# Altium schematic sheet 01_digital_back_end.SchDoc
size A3; SheetNumber: 1; SheetTotal: 2
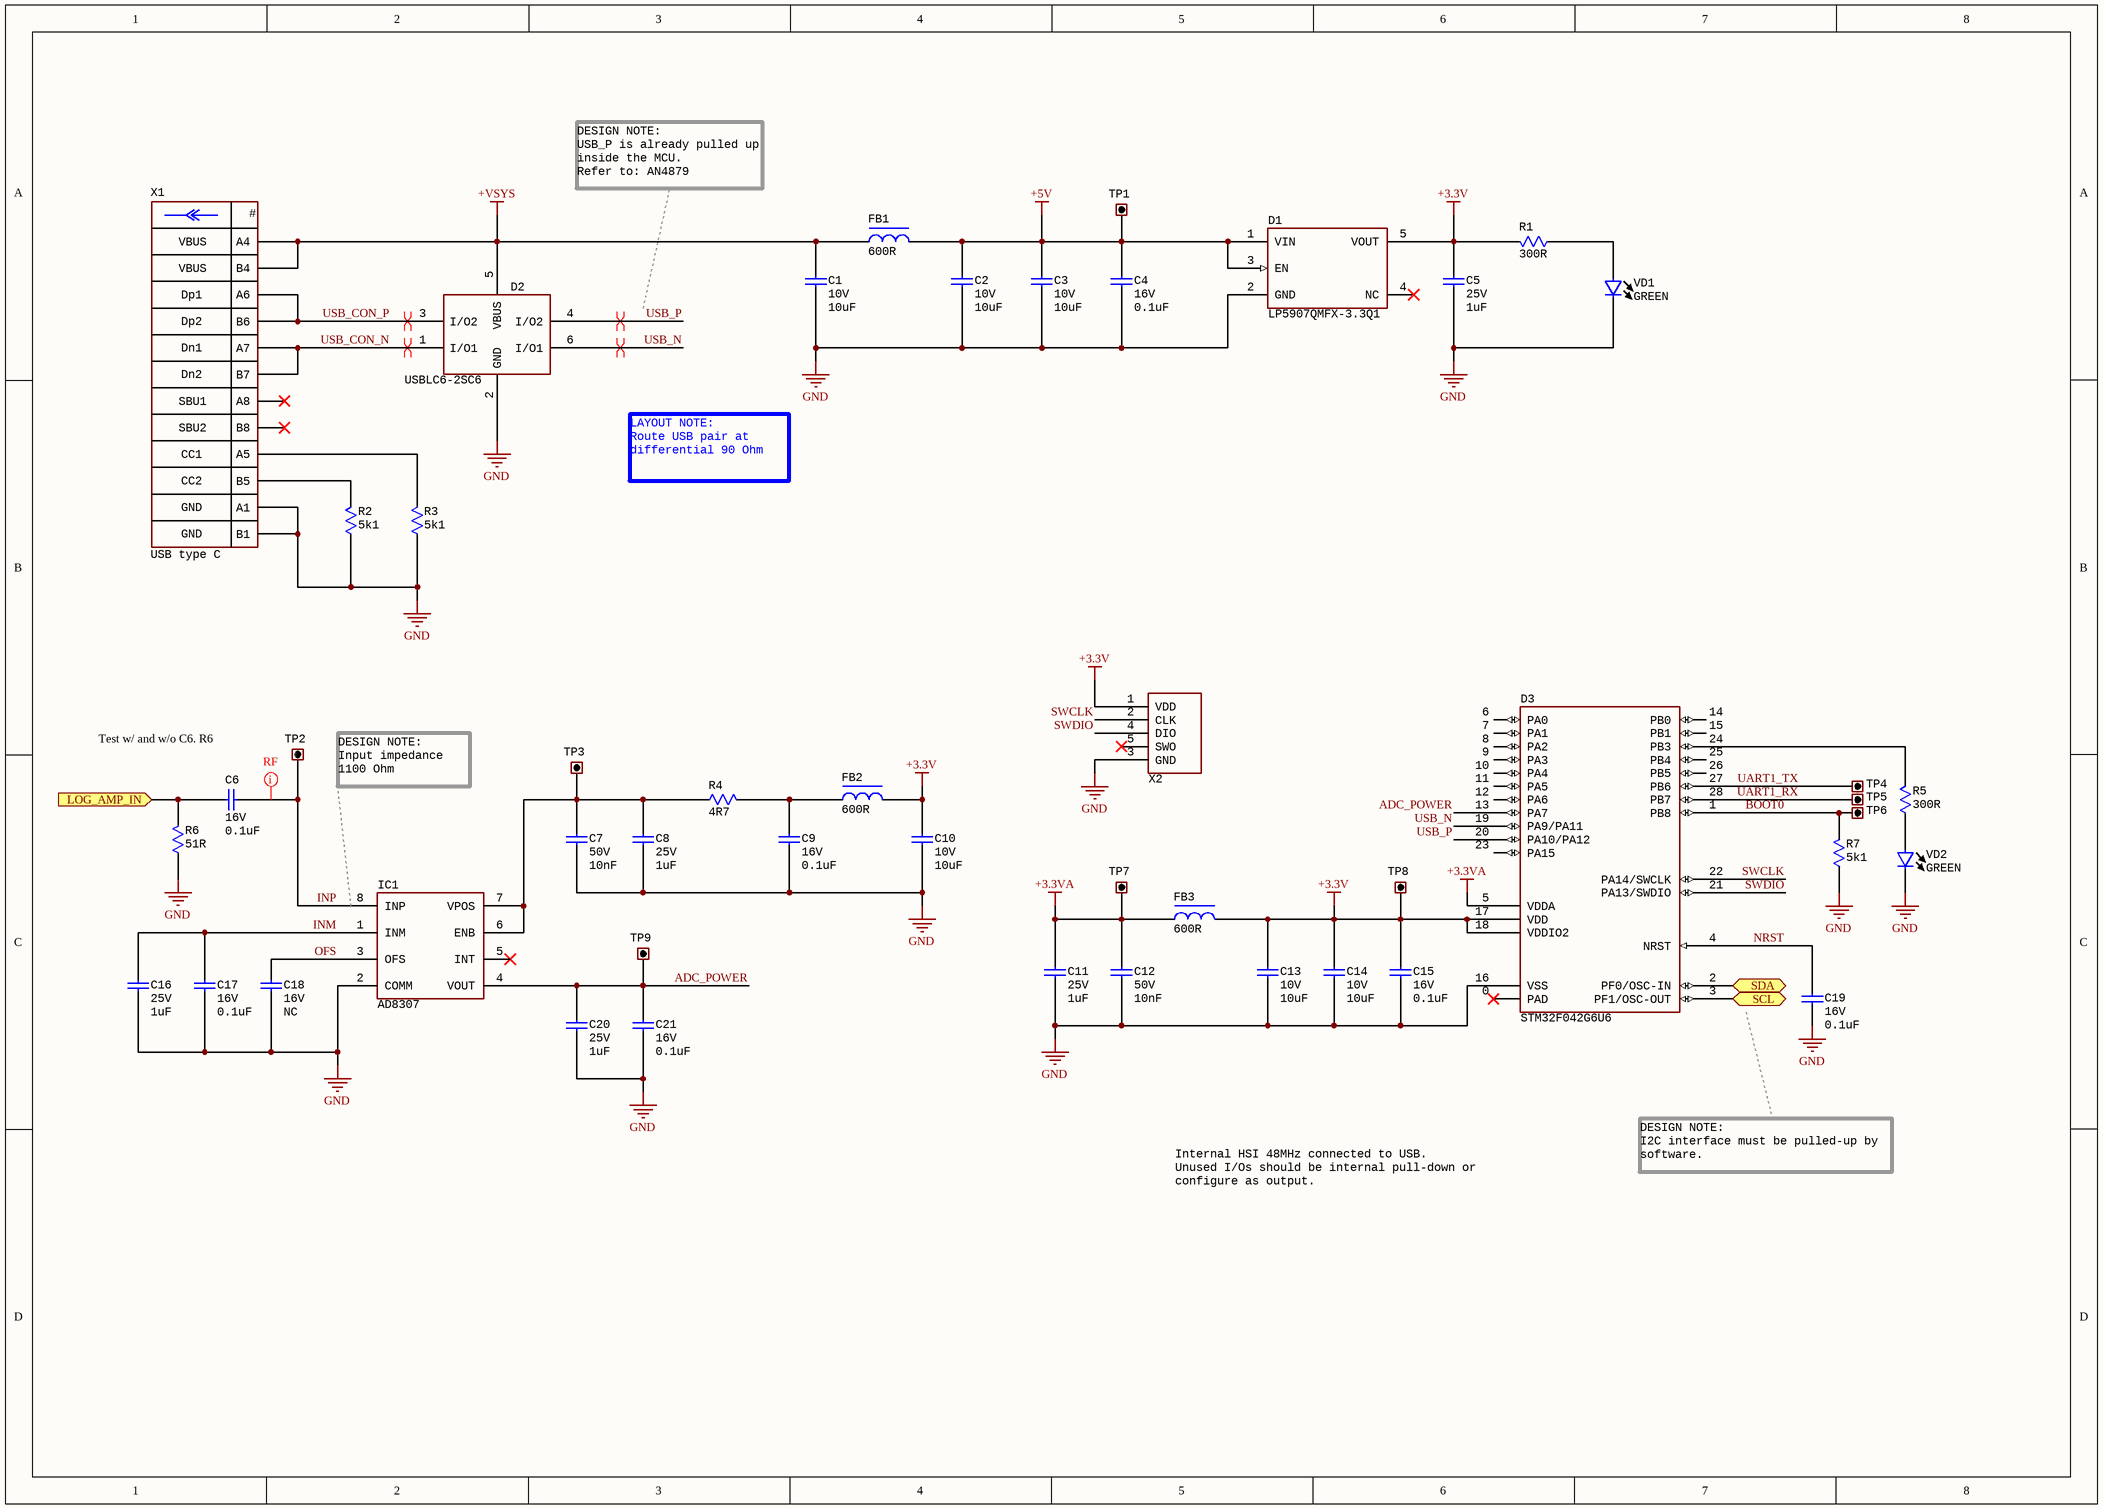
[diagram p0: 01_digital_back_end.SchDoc]

## Parts
C1  value 10uF  Voltage: 10V  [CAP: 0603]
C2  value 10uF  Voltage: 10V  [CAP: 0603]
C3  value 10uF  Voltage: 10V  [CAP: 0603]
C4  value 0.1uF  Voltage: 16V  [CAP: 0402]
C5  value 1uF  Voltage: 25V  [CAP: 0402]
C6  value 0.1uF  Voltage: 16V  [CAP: 0402]
C7  value 10nF  Voltage: 50V  [CAP: 0402]
C8  value 1uF  Voltage: 25V  [CAP: 0402]
C9  value 0.1uF  Voltage: 16V  [CAP: 0402]
C10  value 10uF  Voltage: 10V  [CAP: 0603]
C11  value 1uF  Voltage: 25V  [CAP: 0402]
C12  value 10nF  Voltage: 50V  [CAP: 0402]
C13  value 10uF  Voltage: 10V  [CAP: 0603]
C14  value 10uF  Voltage: 10V  [CAP: 0603]
C15  value 0.1uF  Voltage: 16V  [CAP: 0402]
C16  value 1uF  Voltage: 25V  [CAP: 0402]
C17  value 0.1uF  Voltage: 16V  [CAP: 0402]
C18  value NC  Voltage: 16V  [CAP: 0402]  (no BOM)
C19  value 0.1uF  Voltage: 16V  [CAP: 0402]
C20  value 1uF  Voltage: 25V  [CAP: 0402]
C21  value 0.1uF  Voltage: 16V  [CAP: 0402]
D1  LP5907QMFX-3.3Q1  [SOT23-5]
D2  (no value)  [SOT23-6]
D3  STM32F042G6U6  [28-QFN (4x4)]
FB1  Resistance: 600R  [IND: 0603]
FB2  Resistance: 600R  [IND: 0603]
FB3  Resistance: 600R  [IND: 0603]
IC1  AD8307  [8-SOIC]
R1  value 300R  [RES: 0603]
R2  value 5k1  [RES: 0603]
R3  value 5k1  [RES: 0603]
R4  value 4R7  [RES: 0603]
R5  value 300R  [RES: 0603]
R6  value 51R  [RES: 0603]
R7  value 5k1  [RES: 0603]
TP1  (no value)  [CON: test_point]  (no BOM)
TP2  (no value)  [CON: test_point]  (no BOM)
TP3  (no value)  [CON: test_point]  (no BOM)
TP4  (no value)  [CON: test_point]  (no BOM)
TP5  (no value)  [CON: test_point]  (no BOM)
TP6  (no value)  [CON: test_point]  (no BOM)
TP7  (no value)  [CON: test_point]  (no BOM)
TP8  (no value)  [CON: test_point]  (no BOM)
TP9  (no value)  [CON: test_point]  (no BOM)
VD1  Color: GREEN  [LED: 0603B]
VD2  Color: GREEN  [LED: 0603B]
X1  CommentText: USB type C  [CON: TYPE-C-31-M-12]
X2  (no value)  [CON: 1.27 Pogo Pin contact]  (no BOM)

## Ports
LOG_AMP_IN (in, see 02_rf_front_end[7B]), SCL (bidir, see 02_rf_front_end[5C]), SDA (bidir, see 02_rf_front_end[5C])

## Nets
+3.3V: C5.1 C10.1 C13.1 C14.1 C15.1 D1.5(VOUT) D3.17(VDD) D3.18(VDDIO2) FB2.1 FB3.1 R1.2 TP8.1 X2.1(VDD)
+3.3VA: C11.1 C12.1 D3.5(VDDA) FB3.2 TP7.1
+5V: C2.1 C3.1 C4.1 D1.1(VIN) D1.3(EN) FB1.1 TP1.1
+VSYS: C1.1 D2.5(VBUS) FB1.2 X1.A4 X1.B4
GND: C1.2 C2.2 C3.2 C4.2 C5.2 C7.2 C8.2 C9.2 C10.2 C11.2 C12.2 C13.2 C14.2 C15.2 C16.2 C17.2 C18.2 C19.2 C20.2 C21.2 D1.2(GND) D2.2(GND) D3.16(VSS) IC1.2(COMM) R2.1 R3.1 R6.1 R7.1 VD1.2 VD2.2 X1.A1 X1.B1 X2.3(GND)
ADC_POWER: C20.1 C21.1 D3.13(PA7) IC1.4(VOUT) TP9.1
BOOT0: D3.1(PB8) R7.2 TP6.1
INM: C16.1 C17.1 IC1.1(INM)
INP: C6.2 IC1.8(INP) TP2.1
LOG_AMP_IN: C6.1 R6.2 ; port LOG_AMP_IN
NRST: C19.1 D3.4(NRST)
OFS: C18.1 IC1.3(OFS)
SCL: D3.3(PF1/OSC-OUT) ; port SCL
SDA: D3.2(PF0/OSC-IN) ; port SDA
SWCLK: D3.22(PA14/SWCLK) X2.2(CLK)
SWDIO: D3.21(PA13/SWDIO) X2.4(DIO)
UART1_RX: D3.28(PB7) TP5.1
UART1_TX: D3.27(PB6) TP4.1
USB_CON_N: D2.1(I/O1) X1.A7 X1.B7
USB_CON_P: D2.3(I/O2) X1.A6 X1.B6
USB_N: D2.6(I/O1) D3.19(PA9/PA11)
USB_P: D2.4(I/O2) D3.20(PA10/PA12)
NetC7_1: C7.1 C8.1 IC1.6(ENB) IC1.7(VPOS) R4.1 TP3.1
NetC9_1: C9.1 FB2.2 R4.2
NetD3_24: D3.24(PB3) R5.2
NetR1_1: R1.1 VD1.1
NetR2_2: R2.2 X1.B5
NetR3_2: R3.2 X1.A5
NetR5_1: R5.1 VD2.1

Not connected (* = marked no-connect by the designer): D1 4(NC)*; D3 0(PAD)* 6(PA0) 7(PA1) 8(PA2) 9(PA3) 10(PA4) 11(PA5) 12(PA6) 14(PB0) 15(PB1) 23(PA15) 25(PB4) 26(PB5); IC1 5(INT)*; X1 A8* B8*; X2 5(SWO)*

## Layout directives
differential pair: USB_CON_N, USB_CON_P, USB_N, USB_P
net class RF: INP

## Notes on the sheet
- DESIGN NOTE:
  USB_P is already pulled up inside the MCU.
  Refer to: AN4879
- LAYOUT NOTE:
  Route USB pair at differential 90 Ohm
- Test w/ and w/o C6. R6
- (near TP2) DESIGN NOTE:
  Input impedance 1100 Ohm
- DESIGN NOTE:
  I2C interface must be pulled-up by software.
- Internal HSI 48MHz connected to USB.
  Unused I/Os should be internal pull-down or configure as output.
- (in symbol Connector_USB_Type_C) #; VBUS; Dp1; Dp2; Dn1; Dn2; SBU1; SBU2; CC1; CC2; GND

## Library data of the parts
C1-C3 C10 C13 C14 = Ceramic: Manufacturer: Samsung Electro-Mechanics; PartNumber: CL10A106KP8NNNC; ValueManufacturerPartNumber: Ceramic capacitor, 10uF, X5R, ±10%, 10V, 0603, -55...+125°C; TypeCapacitor: Ceramic capacitor; Tolerance: ±10%; TypeDielectric: X5R; Package: 0603; HelpURL: https://jlcpcb.com/partdetail/20411-CL10A106KP8NNNC/C19702; Temperature: -55...+125°C; JLCPCB Part #: C19702
C4 C6 C9 C15 C17 C19 C21 = Ceramic: Manufacturer: Samsung Electro-Mechanics; PartNumber: CL05B104KO5NNNC; ValueManufacturerPartNumber: Ceramic capacitor, 0.1uF, X7R, ±10%, 16V, 0402, -55...+125°C; TypeCapacitor: Ceramic capacitor; Tolerance: ±10%; TypeDielectric: X7R; Package: 0402; HelpURL: https://jlcpcb.com/partdetail/1877-CL05B104KO5NNNC/C1525; Temperature: -55...+125°C; JLCPCB Part #: C1525
C5 C8 C11 C16 C20 = Ceramic: Manufacturer: Samsung Electro-Mechanics; PartNumber: CL05A105KA5NQNC; ValueManufacturerPartNumber: Ceramic capacitor, 1uF, X5R, ±10%, 25V, 0402, -55...+125°C; TypeCapacitor: Ceramic capacitor; Tolerance: ±10%; TypeDielectric: X5R; Package: 0402; HelpURL: https://jlcpcb.com/partdetail/53938-CL05A105KA5NQNC/C52923; Temperature: -55...+125°C; JLCPCB Part #: C52923
C7 C12 = Ceramic: Manufacturer: Samsung Electro-Mechanics; PartNumber: CL05B103KB5NNNC; ValueManufacturerPartNumber: Ceramic capacitor, 10nF, X7R, ±10%, 50V, 0402, -55...+125°C; TypeCapacitor: Ceramic capacitor; Tolerance: ±10%; TypeDielectric: X7R; Package: 0402; HelpURL: https://jlcpcb.com/partdetail/15869-CL05B103KB5NNNC/C15195; Temperature: -55...+125°C; JLCPCB Part #: C15195
C18 = Ceramic: Manufacturer: Yageo; PartNumber: CC0201KRX7R7BB103; ValueManufacturerPartNumber: Ceramic capacitor, NC, X7R, ±10%, 16V, 0603, -55...+125°C; TypeCapacitor: Ceramic capacitor; Tolerance: ±10%; TypeDielectric: X7R; Package: 0603; HelpURL: https://www.digikey.com/product-detail/en/yageo/CC0201KRX7R7BB103/311-1404-1-ND/2833710; Temperature: -55...+125°C
D1 = LDO: ValueManufacturerPartNumber: LP5907QMFX-3.3Q1; PartNumber: LP5907QMFX-3.3Q1
D2 = USBLC6-2SC6: Manufacturer: STMicroelectronics; TypeDiode: USB protection; Current: 5A peak; VoltageDrop: 17V; RecoveryTime: Power line; Package: SOT-23-6; HelpURL: https://www.digikey.com/product-detail/en/stmicroelectronics/USBLC6-2SC6/497-5235-1-ND/1121688; ValueManufacturerPartNumber: =TypeDiode+', '+Voltage+', '+Current+', '+VoltageDrop+', '+RecoveryTime+', '+Package+', '+Temperature; Temperature: -40...+125°C; PartNumber: USBLC6-2SC6
D3 = STM32F042G6U6: Cortex-M0, 48MHz, 32KB ROM, 6KB RAM, 2.4...3.6V, QFN-28, -40...+85°C; Manufacturer: STMicroelectronics; HelpURL: https://eu.mouser.com/ProductDetail/STMicroelectronics/STM32F042K6U6?qs=4l9S5vBWkUI1HFPPlP09zA%3D%3D; Package: QFN-28; PartNumber: STM32F042G6U6; JLCPCB Part #: C961597
FB1-FB3 = Ferrite_Bead_SMD: Manufacturer: Sunlord; PartNumber: LQP03TNR10J02D; TypeInductor: Ferrite Bead; MaxCurrent: 200mA; Frequency: 100 MHz; Package: 0603; HelpURL: https://www.digikey.com/product-detail/en/murata-electronics-north-america/LQP03TNR10J02D/490-6742-1-ND/3845939; ValueManufacturerPartNumber: =TypeInductor+', '+Value+', '+Tolerance+', '+Package+', '+MaxCurrent+', '+Temperature; Temperature: -55...+125°C; JLCPCB Part #: C1002
IC1 = AD8307: Integrated Circuit; Manufacturer_Name: Analog Devices; Datasheet Link: https://www.arrow.com/en/products/ad8310arm/analog-devices; Height: 1.1mm; Manufacturer_Part_Number: AD8307; Mouser Price/Stock: https://www.mouser.com/Search/Refine.aspx?Keyword=584-AD8310ARM; Arrow Price/Stock: https://www.arrow.com/en/products/ad8310arm/analog-devices
R1 R5 = Resistor: Manufacturer: Yageo; PartNumber: RC0201JR-07100RL; ValueManufacturerPartNumber: Resistor film, 300R, ±5%, 0603, 0.05W, -55...+125°C; TypeResistor: Resistor film; Power: 0.05W; Tolerance: ±5%; Package: 0603; HelpURL: https://www.digikey.com/product-detail/en/yageo/RC0201JR-07100RL/311-100NCT-ND/1949006; Temperature: -55...+125°C; JLCPCB Part #: C23025
R2 R3 = Resistor: Manufacturer: Yageo; PartNumber: 0603WAF5101T5E; ValueManufacturerPartNumber: Resistor film, 5k1, ±5%, 0603, 0.05W, -55...+125°C; TypeResistor: Resistor film; Power: 0.05W; Tolerance: ±5%; Package: 0603; HelpURL: https://lcsc.com/product-detail/Chip-Resistor-Surface-Mount_UNI-ROYAL-Uniroyal-Elec-0603WAF5101T5E_C23186.html; Temperature: -55...+125°C; JLCPCB Part #: C23186
R4 = Resistor: Manufacturer: Yageo; PartNumber: RC0201JR-07100RL; ValueManufacturerPartNumber: Resistor film, 4R7, ±5%, 0603, 0.05W, -55...+125°C; TypeResistor: Resistor film; Power: 0.05W; Tolerance: ±5%; Package: 0603; HelpURL: https://www.digikey.com/product-detail/en/yageo/RC0201JR-07100RL/311-100NCT-ND/1949006; Temperature: -55...+125°C; JLCPCB Part #: C23164
R6 = Resistor: Manufacturer: Yageo; PartNumber: 0603WAF5101T5E; ValueManufacturerPartNumber: Resistor film, 51R, ±5%, 0603, 0.05W, -55...+125°C; TypeResistor: Resistor film; Power: 0.05W; Tolerance: ±5%; Package: 0603; HelpURL: https://lcsc.com/product-detail/Chip-Resistor-Surface-Mount_UNI-ROYAL-Uniroyal-Elec-0603WAF5101T5E_C23186.html; Temperature: -55...+125°C; JLCPCB Part #: C23197
R7 = Resistor: Manufacturer: Yageo; PartNumber: RC0201JR-07100RL; ValueManufacturerPartNumber: Resistor film, 5k1, ±5%, 0603, 0.05W, -55...+125°C; TypeResistor: Resistor film; Power: 0.05W; Tolerance: ±5%; Package: 0603; HelpURL: https://www.digikey.com/product-detail/en/yageo/RC0201JR-07100RL/311-100NCT-ND/1949006; Temperature: -55...+125°C; JLCPCB Part #: C23186
TP1-TP9 = Connector_Test_Point: Manufacturer: Keystone; ValueManufacturerPartNumber: Test point, Keystone, 5001; PartNumber: 5001; TypeConnector: Test point; HelpURL: https://www.digikey.com/product-detail/en/keystone-electronics/5001/36-5001-ND/255327
VD1 VD2 = LED_single: ValueManufacturerPartNumber: LED, Green, *, *, *, -55...+150°C; TypeDiode: LED; Manufacturer: *; Package: *; HelpURL: *; Temperature: -55...+150°C; Current: *; VoltageDrop: *; PartNumber: *; ColorParameter: Green; JLCPCB Part #: C72041
X1 = Connector_USB_Type_C: Manufacturer: Korean Hroparts; ValueManufacturerPartNumber: USB Type C, 3A; PartNumber: TYPE-C-31-M-12; CurrentMax: 3A; HelpURL: https://lcsc.com/product-detail/USB-Type-C_Korean-Hroparts-Elec-TYPE-C-31-M-12_C165948.html; TypeConnector: USB Type C
X2 = Connector SWD: SWD Interface